# Altium schematic sheet tmtr_board_rev1_2.SchDoc: tmtr_board_rev1.sch
size 282 x 200 mm; Date: 12/27/2014 6:12:11 PM; SheetNumber: Sheet:
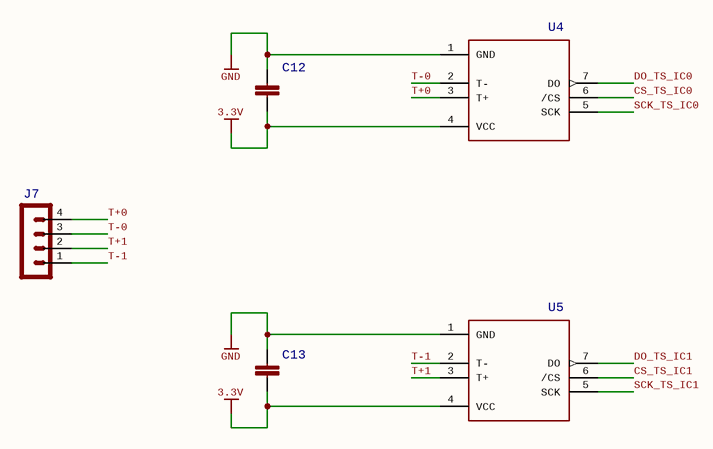
[diagram p0: tmtr_board_rev1_2.SchDoc]

## Parts
C12  CAP0805  [0805]  (value not drawn)
C13  CAP0805  [0805]  (value not drawn)
J7  <b>PIN HEADER</b>  [MA04-1]  (value not drawn)
U4  MAX31855  [SO08]  (value not drawn)
U5  MAX31855  [SO08]  (value not drawn)

## Nets
3.3V: C12.1 C13.1 U4.4(VCC) U5.4(VCC)
GND: C12.2 C13.2 U4.1(GND) U5.1(GND)
CS_TS_IC0: U4.6(/CS)
CS_TS_IC1: U5.6(/CS)
DO_TS_IC0: U4.7(DO)
DO_TS_IC1: U5.7(DO)
SCK_TS_IC0: U4.5(SCK)
SCK_TS_IC1: U5.5(SCK)
T+0: J7.4 U4.3(T+)
T+1: J7.2 U5.3(T+)
T-0: J7.3 U4.2(T-)
T-1: J7.1 U5.2(T-)

## Notes on the sheet
- 1
- 2
- 3
- 4
- 5
- 6
- A
- B
- C
- D

## Library data of the parts
C12 C13 = CAP0805: <b>Capacitor</b> / Standard 0603 ceramic capacitor, and 0.1" leaded capacitor.; Value: 0.1uF
J7 = MA04-1: OC_FARNELL: unknown; OC_NEWARK: unknown
U4 U5 = MAX6675: Value: MAX31855